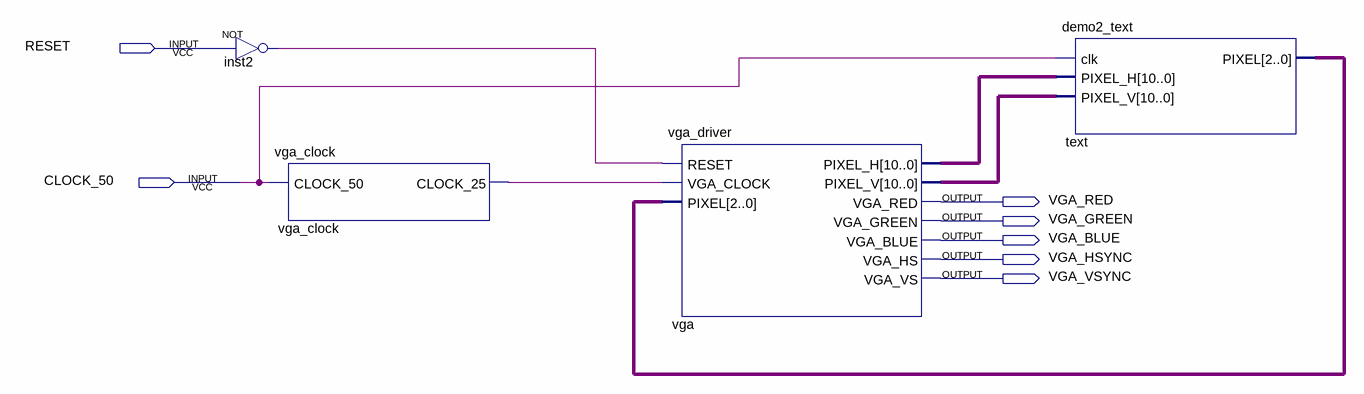
[diagram p0: schematic sheet]
// Quartus schematic text.bdf as structural Verilog: 4 symbols, 7 pins
module text (
  input  RESET,
  input  CLOCK_50,
  output VGA_RED,
  output VGA_GREEN,
  output VGA_BLUE,
  output VGA_HSYNC,
  output VGA_VSYNC
);

  wire inst2_out, vga_clock_clock_25;
  wire [2:0] text_pixel;
  wire [10:0] vga_pixel_h, vga_pixel_v;

  not inst2 (inst2_out, RESET);
  vga_clock vga_clock (.CLOCK_50(CLOCK_50), .CLOCK_25(vga_clock_clock_25));
  vga_driver vga (
    .RESET(inst2_out), .VGA_CLOCK(vga_clock_clock_25), .PIXEL(text_pixel), .PIXEL_H(vga_pixel_h),
    .PIXEL_V(vga_pixel_v), .VGA_RED(VGA_RED), .VGA_GREEN(VGA_GREEN), .VGA_BLUE(VGA_BLUE), .VGA_HS(VGA_HSYNC),
    .VGA_VS(VGA_VSYNC));
  demo2_text text (.clk(CLOCK_50), .PIXEL_H(vga_pixel_h), .PIXEL_V(vga_pixel_v), .PIXEL(text_pixel));
endmodule
